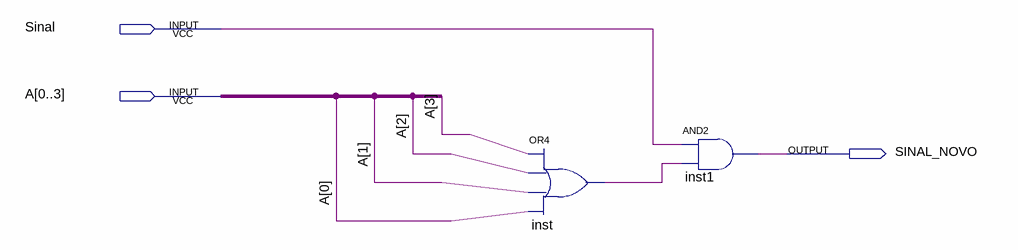
[diagram p0: schematic sheet]
// Quartus schematic Corretor_0.bdf as structural Verilog: 2 symbols, 3 pins
module Corretor_0 (
  input  Sinal,
  input  [0:3] A,
  output SINAL_NOVO
);

  wire inst_out;

  or inst (inst_out, A[3], A[2], A[1], A[0]);
  and inst1 (SINAL_NOVO, Sinal, inst_out);
endmodule
